# EAGLE design picoAvaR7 (EAGLE 6.1)
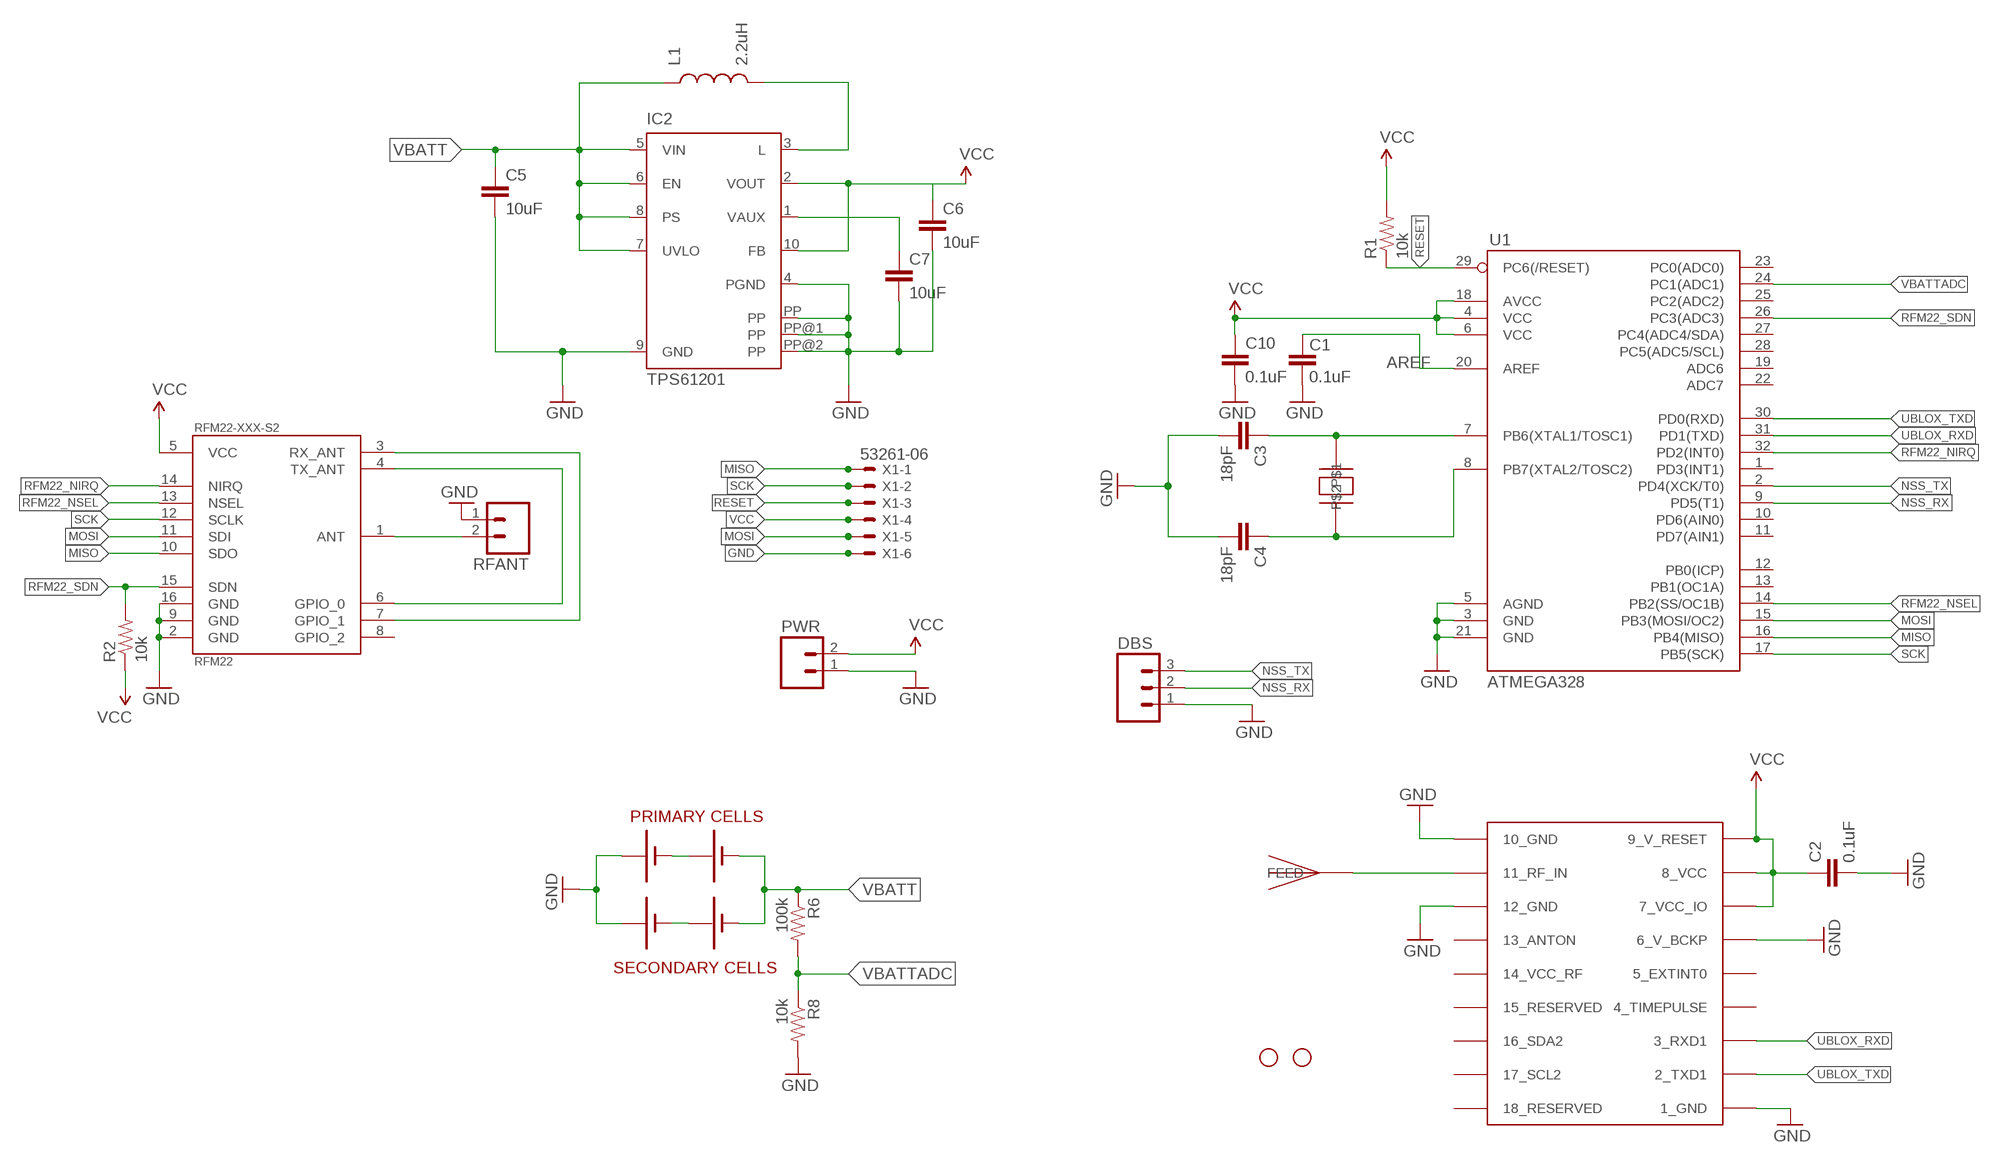
[diagram p0: schematic, sheet 1]

## Parts
C1  0.1uF  CAP0402-CAP  [0402-CAP]
C2  0.1uF  CAP0402-CAP  [0402-CAP]
C3  18pF  CAP0402-CAP  [0402-CAP]
C4  18pF  CAP0402-CAP  [0402-CAP]
C5  10uF  CAP1206  [1206]
C6  10uF  CAP1206  [1206]
C7  10uF  CAP1206  [1206]
C10  0.1uF  CAP0402-CAP  [0402-CAP]
DBS  M03PTH  [1X03]
IC2  TPS61201  [S-PDSO-N10]
JP1  STAND-OFF  [STAND-OFF]
JP2  STAND-OFF  [STAND-OFF]
L1  2.2uH  ELLVGG_INDUCTOR  [ELLVGG_INDUCTOR]
PRIMARYCELL1  KEYSTONE-82-AAA-BATTERY-HOLDER  [KEYSTONE-82-AAA-BATTERY]
PRIMARYCELL2  KEYSTONE-82-AAA-BATTERY-HOLDER  [KEYSTONE-82-AAA-BATTERY]
PWR  M02PTH  [1X02]
R1  10k  RESISTOR0402-RES  [0402-RES]
R2  10k  RESISTOR0402-RES  [0402-RES]
R6  100k  RESISTOR0402-RES  [0402-RES]
R8  10k  RESISTOR0402-RES  [0402-RES]
RFANT  M02PTH  [1X02]
RFM22-XXX-S2  RFM22  [RFM22-XXX-S2]
SECONDARYCELL1  KEYSTONE-82-AAA-BATTERY-HOLDER  [KEYSTONE-82-AAA-BATTERY]
SECONDARYCELL2  KEYSTONE-82-AAA-BATTERY-HOLDER  [KEYSTONE-82-AAA-BATTERY]
U1  ATMEGA328  ATMEGA168  [TQFP32-08]
U$1  UBLOX_MAX-6  [UBLOX_MAX-6]
U$2  ABRACON_ABM3_CRYSTAL  [ABRACON_ABM3_CRYSTAL]
U$3  JTI_ANTENNA-1575AT43A40  [JTI_ANTENNA-1575AT43A40]
X1  53261-06  [53261-06]

## Nets
AREF: C1.2 U1.20(AREF)
GND [vcc]: C1.1 C2.2 C3.2 C4.2 C5.2 C6.2 C7.2 C10.2 DBS.1 IC2.4(PGND) IC2.9(GND) IC2.PP IC2.PP@1(PP) IC2.PP@2(PP) PRIMARYCELL1.VBATT1(+) PRIMARYCELL1.VBATT(+) PWR.1 R8.2 RFANT.1 RFM22-XXX-S2.2(GND) RFM22-XXX-S2.9(GND) RFM22-XXX-S2.16(GND) SECONDARYCELL1.VBATT1(+) SECONDARYCELL1.VBATT(+) U1.3(GND) U1.5(AGND) U1.21(GND) U$1.1_GND U$1.6_V_BCKP U$1.10_GND U$1.12_GND X1.6
MISO: RFM22-XXX-S2.10(SDO) U1.16(PB4(MISO)) X1.1
MOSI: RFM22-XXX-S2.11(SDI) U1.15(PB3(MOSI/OC2)) X1.5
N$1: PRIMARYCELL1.GND2(-) PRIMARYCELL1.GND(-) PRIMARYCELL2.VBATT1(+) PRIMARYCELL2.VBATT(+)
N$2: SECONDARYCELL1.GND2(-) SECONDARYCELL1.GND(-) SECONDARYCELL2.VBATT1(+) SECONDARYCELL2.VBATT(+)
N$3: RFANT.2 RFM22-XXX-S2.1(ANT)
N$4: U$1.11_RF_IN U$3.FEED
N$5: RFM22-XXX-S2.3(RX_ANT) RFM22-XXX-S2.7(GPIO_1)
N$6: RFM22-XXX-S2.4(TX_ANT) RFM22-XXX-S2.6(GPIO_0)
N$7: IC2.3(L) L1.P$2
N$9: C3.1 U1.7(PB6(XTAL1/TOSC1)) U$2.P$2
N$10: C4.1 U1.8(PB7(XTAL2/TOSC2)) U$2.P$1
N$11: C7.1 IC2.1(VAUX)
NSS_RX: DBS.2 U1.9(PD5(T1))
NSS_TX: DBS.3 U1.2(PD4(XCK/T0))
RESET: R1.1 U1.29(PC6(/RESET)) X1.3
RFM22_NIRQ: RFM22-XXX-S2.14(NIRQ) U1.32(PD2(INT0))
RFM22_NSEL: RFM22-XXX-S2.13(NSEL) U1.14(PB2(SS/OC1B))
RFM22_SDN: R2.2 RFM22-XXX-S2.15(SDN) U1.26(PC3(ADC3))
SCK: RFM22-XXX-S2.12(SCLK) U1.17(PB5(SCK)) X1.2
UBLOX_RXD: U1.31(PD1(TXD)) U$1.3_RXD1
UBLOX_TXD: U1.30(PD0(RXD)) U$1.2_TXD1
VBATT [vcc]: C5.1 IC2.5(VIN) IC2.6(EN) IC2.7(UVLO) IC2.8(PS) L1.P$1 PRIMARYCELL2.GND2(-) PRIMARYCELL2.GND(-) R6.1 SECONDARYCELL2.GND2(-) SECONDARYCELL2.GND(-)
VBATTADC: R6.2 R8.1 U1.24(PC1(ADC1))
VCC: C2.1 C6.1 C10.1 IC2.2(VOUT) IC2.10(FB) PWR.2 R1.2 R2.1 RFM22-XXX-S2.5(VCC) U1.4(VCC) U1.6(VCC) U1.18(AVCC) U$1.7_VCC_IO U$1.8_VCC U$1.9_V_RESET X1.4
Unconnected: RFM22-XXX-S2.8(GPIO_2) U1.1(PD3(INT1)) U1.10(PD6(AIN0)) U1.11(PD7(AIN1)) U1.12(PB0(ICP)) U1.13(PB1(OC1A)) U1.19(ADC6) U1.22(ADC7) U1.23(PC0(ADC0)) U1.25(PC2(ADC2)) U1.27(PC4(ADC4/SDA)) U1.28(PC5(ADC5/SCL)) U$1.4_TIMEPULSE U$1.5_EXTINT0 U$1.13_ANTON U$1.14_VCC_RF U$1.15_RESERVED U$1.16_SDA2 U$1.17_SCL2 U$1.18_RESERVED

## Notes on the sheet
- PRIMARY CELLS
- SECONDARY CELLS

## Library data of the parts
C1-C7 C10 = SparkFun:CAP: Capacitor Standard 0603 ceramic capacitor, and 0.1" leaded capacitor.
DBS = SparkFun:M03: Header 3 Standard 3-pin 0.1" header. Use with straight break away headers (SKU : PRT-00116), right angle break away headers (PRT-00553), swiss pins (PRT-00743), machine pins (PRT-00117), and female headers (PRT-00115). Molex polarized connector foot print use with SKU : PRT-08232 with associated crimp pins and housings.
IC2 = texas:TPS6120*: LOW INPUT VOLTAGE SYNCHRONOUS BOOST CONVERTER WITH 1.3-A SWITCHES Source: http://focus.ti.com/lit/ds/symlink/tps61200.pdf; MPN: TPS61201DRCT; OC_FARNELL: unknown; OC_NEWARK: 37M0068
JP1 JP2 = SparkFun:STAND-OFF: Stand Off This is the mechanical footprint for a #4 phillips button head screw. Use the keepout ring to avoid running the screw head into surrounding components. SKU : PRT-00447
L1 = ava:ELLVGG_INDUCTOR
PRIMARYCELL1 PRIMARYCELL2 SECONDARYCELL1 SECONDARYCELL2 = ava:KEYSTONE-82-AAA-BATTERY-HOLDER
PWR RFANT = SparkFun:M02: Header 2 Standard 2-pin 0.1" header. Use with straight break away headers (SKU : PRT-00116), right angle break away headers (PRT-00553), swiss pins (PRT-00743), machine pins (PRT-00117), and female headers (PRT-00115). Molex polarized connector foot print use with SKU : PRT-08233 with associated crimp pins and housings.
R1 R2 R6 R8 = SparkFun:RESISTOR: Resistor Basic schematic elements and footprints for 0603, 1206, and PTH resistors.
RFM22-XXX-S2 = SparkFun:RFM22: *Hope RF's RFM22* Packages: RFM22-S2 (SMD)
U1 = SparkFun:ATMEGA168
U$1 = ava:UBLOX_MAX-6: UBLOX MAX-6
U$2 = ava:ABRACON_ABM3_CRYSTAL
U$3 = ava:JTI_ANTENNA-1575AT43A40
X1 = con-molex:53?-06: CONNECTOR wire to board 1.25 mm (.049 inch) pitch header; OC_FARNELL: 1125375; OC_NEWARK: unknown

## Net classes
0 default: width 0.203 mm
1 vcc: width 0.254 mm

## Board
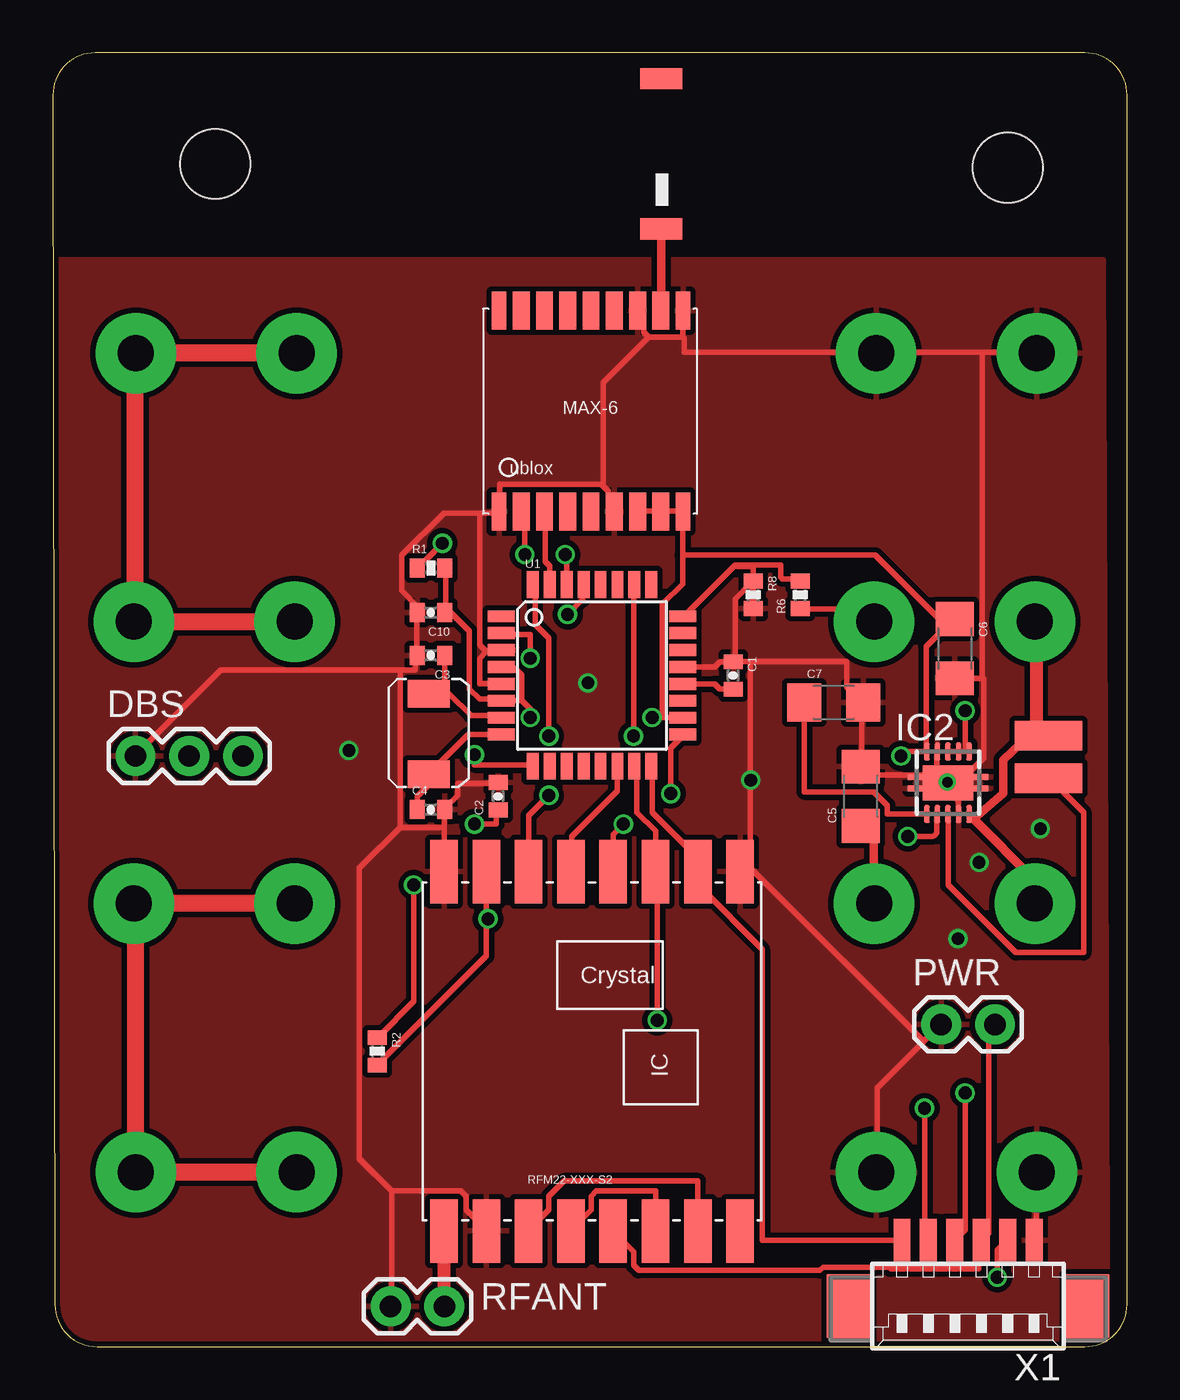
[diagram p1: board, top side]
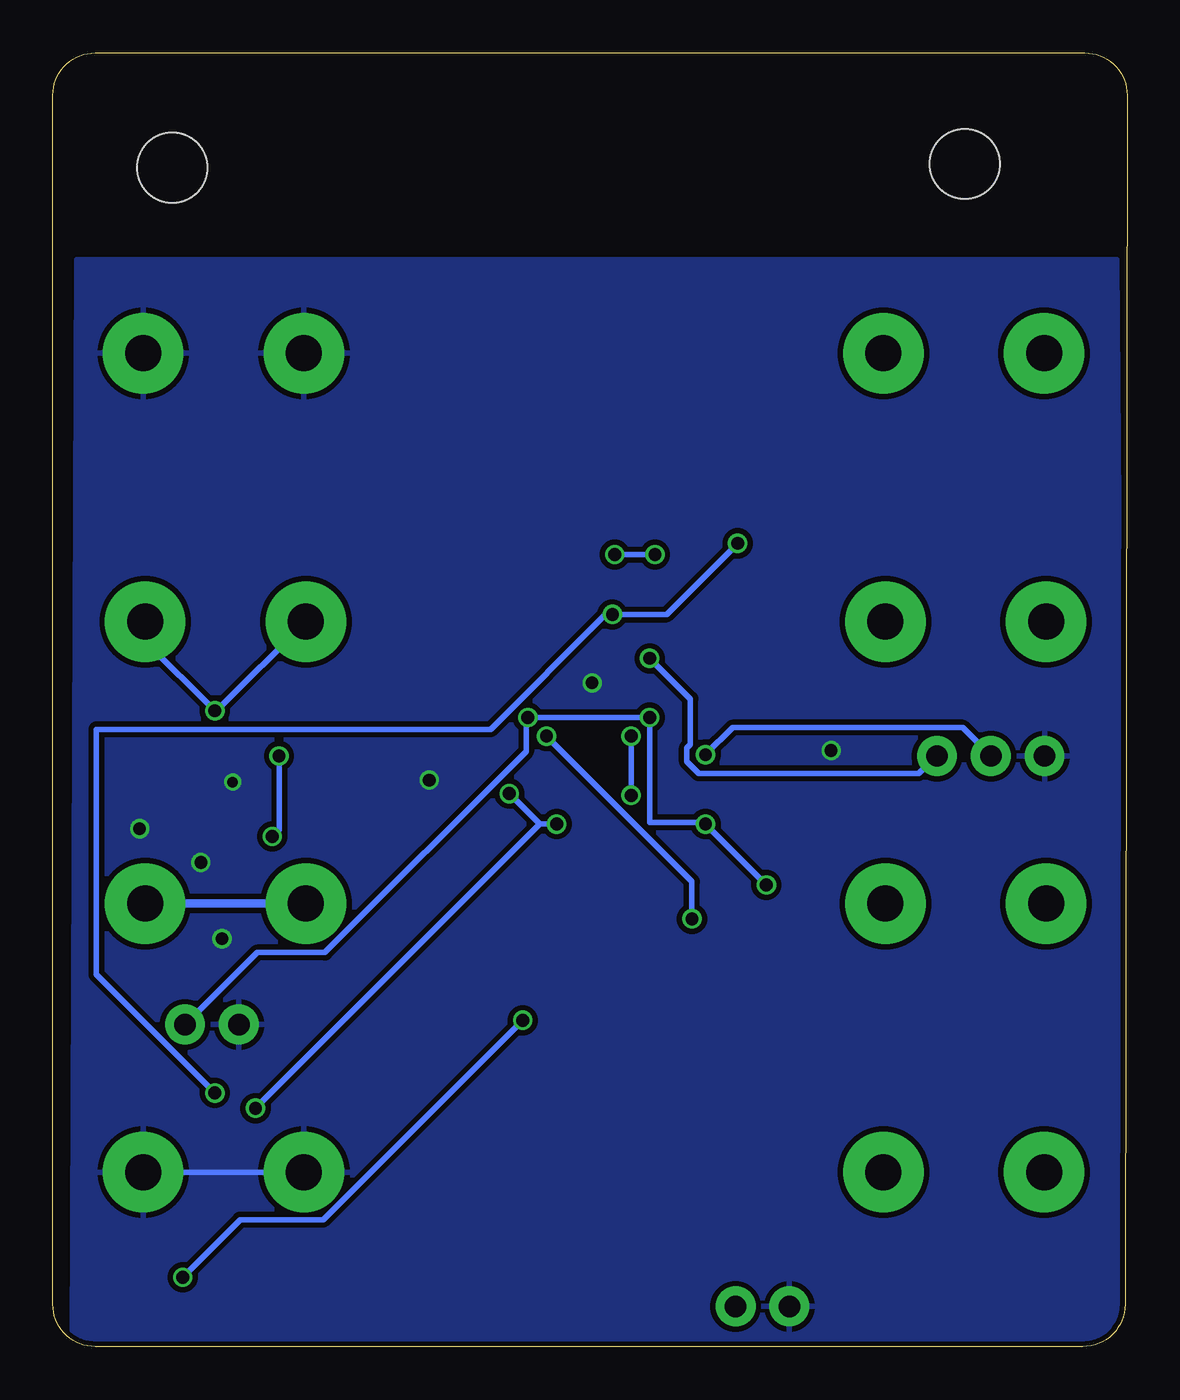
[diagram p2: board, bottom side, seen from below]

Size 50.8 x 61.2 mm. Coordinates in mm from the lower left corner, seen from the top.
Outline: 0,59.2 0.09,2 arc90 2.09,0 48.8,0 arc90 50.8,2 50.8,59.2 arc90 48.8,61.2 2,61.2 arc90 0,59.2
Copper layers (1*16): Top 0.035mm / dielectric 1.5mm / Bottom 0.035mm
Design rules: minimum track width 6mil, minimum drill 12mil, track to track 6mil, track to pad 6mil, pad to pad 6mil, via to via 6mil, smd to smd 0mil, copper to edge 10mil, drill to drill 10mil, minimum pad ring 10mil, minimum via ring 6mil, stop-mask expansion 2mil, vias tented up to drill 100mil, thermal gap 10mil

### Footprints (pad centres in the part's own frame; a part is rotated, then mirrored left to right if it is on the bottom)
0402-CAP = smd 0.7 x 0.9: 1 -0.65,0; 2 0.65,0
1206 = smd 1.6 x 1.8: 1 -1.4,0; 2 1.4,0
1X03 = drill 1.016 pad 1.88: 1 0,0; 2 2.54,0; 3 5.08,0
S-PDSO-N10 = smd 0.28 x 0.85: 1 -1,-1.475; 2 -0.5,-1.475; 3 0,-1.475; 4 0.5,-1.475; 5 1,-1.475; 6 1,1.475; 7 0.5,1.475; 8 0,1.475; 9 -0.5,1.475; 10 -1,1.475 | smd 2.4 x 1.65: PP 0,0 | smd 3.8 x 0.28: PP@1 0,0.275; PP@2 0,-0.275
STAND-OFF = hole 3.302: 0,0
ELLVGG_INDUCTOR = smd 1.4 x 3.2: P$1 -3.81,0; P$2 -1.81,0
KEYSTONE-82-AAA-BATTERY = drill 1.7 pad 3.81: GND -21.57,0; GND2 -13.97,0; VBATT 13.43,0; VBATT1 21.03,0
1X02 = drill 1.016 pad 1.88: 1 0,0; 2 2.54,0
0402-RES = smd 0.7 x 0.9: 1 -0.65,0; 2 0.65,0
RFM22-XXX-S2 = smd 3 x 1.3: 1 -8.5,7; 2 -8.5,5; 3 -8.5,3; 4 -8.5,1; 5 -8.5,-1; 6 -8.5,-3; 7 -8.5,-5; 8 -8.5,-7; 9 8.5,-7; 10 8.5,-5; 11 8.5,-3; 12 8.5,-1; 13 8.5,1; 14 8.5,3; 15 8.5,5; 16 8.5,7
TQFP32-08 = smd 1.27 x 0.559: 1 -4.293,2.8; 2 -4.293,2; 3 -4.293,1.2; 4 -4.293,0.4; 5 -4.293,-0.4; 6 -4.293,-1.2; 7 -4.293,-2; 8 -4.293,-2.8; 17 4.293,-2.8; 18 4.293,-2; 19 4.293,-1.2; 20 4.293,-0.4; 21 4.293,0.4; 22 4.293,1.2; 23 4.293,2; 24 4.293,2.8 | smd 0.559 x 1.27: 9 -2.8,-4.293; 10 -2,-4.293; 11 -1.2,-4.293; 12 -0.4,-4.293; 13 0.4,-4.293; 14 1.2,-4.293; 15 2,-4.293; 16 2.8,-4.293; 25 2.8,4.293; 26 2,4.293; 27 1.2,4.293; 28 0.4,4.293; 29 -0.4,4.293; 30 -1.2,4.293; 31 -2,4.293; 32 -2.8,4.293
UBLOX_MAX-6 = smd 1.8 x 0.7: 1_GND 4.95,-4.4; 9_V_RESET 4.95,4.3; 10_GND -4.55,4.3; 18_RESERVED -4.55,-4.4 | smd 1.8 x 0.8: 2_TXD1 4.95,-3.35; 3_RXD1 4.95,-2.25; 4_TIMEPULSE 4.95,-1.15; 5_EXTINT0 4.95,-0.05; 6_V_BCKP 4.95,1.05; 7_VCC_IO 4.95,2.15; 8_VCC 4.95,3.25; 11_RF_IN -4.55,3.25; 12_GND -4.55,2.15; 13_ANTON -4.55,1.05; 14_VCC_RF -4.55,-0.05; 15_RESERVED -4.55,-1.15; 16_SDA2 -4.55,-2.25; 17_SCL2 -4.55,-3.35
ABRACON_ABM3_CRYSTAL = smd 1.3 x 2: P$1 -3.4,0.1; P$2 0.4,0.1
JTI_ANTENNA-1575AT43A40 = smd 1 x 2: FEED -3.81,-1.27; NC 3.29,-1.27
53261-06 = smd 0.8 x 2: 1 3.125,-2.5; 2 1.875,-2.5; 3 0.625,-2.5; 4 -0.625,-2.5; 5 -1.875,-2.5; 6 -3.125,-2.5 | smd 2.1 x 3: S1 5.625,0.625; S2 -5.625,0.625

### Placement (x,y rotation side)
C1  32.16,31.75 270 top
C2  21.05,26.04 90 top
C3  17.88,32.7 180 top
C4  17.88,25.4 0 top
C5  38.2,26.04 90 top
C6  42.64,33.02 270 top
C7  36.93,30.48 0 top
C10  17.88,34.73 180 top
DBS  3.91,27.94 0 top
IC2  42.32,26.67 0 top
JP1  7.68,55.95 0 top
JP2  45.15,55.77 0 top
L1  47.09,25.08 270 top
PRIMARYCELL1  25.5,8.26 0 top
PRIMARYCELL2  24.86,20.95 180 top
PWR  42.01,15.24 0 top
R1  17.88,36.83 0 top
R2  15.34,13.97 270 top
R6  35.34,35.56 90 top
R8  33.12,35.56 270 top
RFANT  15.97,1.91 0 top
RFM22-XXX-S2  25.5,13.97 90 top
SECONDARYCELL1  25.5,46.99 0 top
SECONDARYCELL2  24.86,34.29 180 top
U1  25.5,31.75 0 top
U$1  25.5,44.45 270 top
U$2  17.88,30.48 90 top
U$3  27.5,56.68 90 top
X1  43.28,2.54 180 top

### Tracks (layer width: path | path; a pad name or v marks a point on that pad's centre or on a via)
AREF
  Top 0.254: U1.20 31.29,31.35 31.53,31.11 32.15,31.11 C1.2
GND  (via drill 0.5, 0.6)
  Top 0.254: U1.21 31.29,32.15 31.53,32.38 32.15,32.38 C1.1 | IC2.4 42.82,25.84 42.34,26.32 IC2.PP@2 IC2.PP | 43.94,31.6 44.02,31.6 44.02,27.84 42.5,26.32 IC2.PP | 43.94,31.6 42.66,31.6 C6.2 | IC2.PP 42.34,26.72 42.34,26.88 IC2.PP@1 42.26,27.04 | R8.2 33.06,36.16 32.26,35.36 32.26,32.48 C1.1 | 32.98,32.4 37.54,32.4 37.54,31.2 38.18,30.56 C7.2 38.26,30.48 38.26,27.44 C5.2 38.34,27.36 38.34,27.04 42.26,27.04 | 32.98,32.4 C1.1 | 32.98,32.4 32.98,22.96 RFM22-XXX-S2.9 32.9,22.72 41.06,14.56 41.06,14.48 41.14,14.4 | X1.6 46.42,5.04 46.5,5.12 46.5,8.24 PRIMARYCELL1.VBATT1 | 41.14,14.4 38.98,12.24 38.98,8.32 PRIMARYCELL1.VBATT | 41.14,14.4 41.94,15.2 PWR.1 | 43.94,47.04 46.5,47.04 SECONDARYCELL1.VBATT1 | 43.94,47.04 38.98,47.04 SECONDARYCELL1.VBATT 38.82,47.04 29.86,47.04 29.86,47.68 29.78,47.76 | 16.02,7.36 19.3,7.36 19.54,7.12 19.54,6.48 20.5,5.52 RFM22-XXX-S2.2 | 16.02,7.36 16.02,1.92 RFANT.1 | RFM22-XXX-S2.16 18.5,24.56 | 18.5,24.56 18.5,25.36 C4.2 18.58,25.52 19.14,26.08 19.14,26.64 20.98,26.64 C2.2 | 28.18,47.76 27.94,48 27.94,48.72 27.7,48.96 U$1.12_GND | 29.78,47.76 28.18,47.76 | 29.78,47.76 29.78,48.96 U$1.10_GND | 20.5,32.88 20.18,32.56 20.18,31.36 21.14,31.36 U1.5 | 20.5,32.88 21.14,32.88 U1.3 | 20.18,39.44 21.06,39.44 U$1.1_GND 21.14,39.6 21.14,40.8 25.94,40.8 | 20.18,39.44 18.5,39.44 16.5,37.44 16.5,35.76 17.22,35.04 C10.2 17.22,34.88 17.22,32.72 C3.2 17.14,32.64 17.14,32 16.42,32 | 25.94,40.8 26.26,40.48 26.26,39.76 26.5,39.52 U$1.6_V_BCKP | 20.5,32.88 20.18,33.2 20.18,39.44 | 28.18,47.76 26.02,45.6 26.02,40.88 25.94,40.8 | 16.42,32 7.94,32 3.94,28 DBS.1 | 16.42,24.56 18.5,24.56
  Top 0.254: 16.42,32 16.42,24.56 | 16.02,7.36 14.5,8.88 14.5,22.64 16.42,24.56 | 43.94,47.04 43.94,31.6 | 42.26,27.04 41.8,27.5 41.8,28.12 IC2.9
  Bottom 0.254: PRIMARYCELL1.VBATT1 46.5,8.24 38.98,8.24 PRIMARYCELL1.VBATT
  other vias: 33,26.8 46.7,24.5 43.8,22.9 42.8,19.3 25.3,31.4 14,28.2 42.3,26.7
  pour Top (isolate 0.254): 0.1,51.42 49.68,51.42 49.88,0 2.1,0 arc-90 0.1,2
  pour Bottom (isolate 0.254): 0.5,51.42 49.68,51.42 49.88,0 2.1,0 arc-90 0.1,2
MISO
  Top 0.254: U1.16 28.34,27.44 28.34,25.28 30.5,23.12 RFM22-XXX-S2.10 30.58,22.4 30.58,21.76 33.54,18.8 33.54,5.04 X1.1
MOSI  (via drill 0.61)
  Top 0.254: U1.15 27.54,27.44 27.62,27.36 27.62,25.28 28.5,24.4 RFM22-XXX-S2.11 28.58,22.4 v28.58,15.44 | v44.66,3.28 44.66,4.56 X1.5
  Bottom 0.254: v44.66,3.28 41.94,6 38.02,6 v28.58,15.44
N$1
  Top 0.813: PRIMARYCELL2.VBATT1 3.91,20.95 | 11.43,8.35 PRIMARYCELL1.GND2 PRIMARYCELL1.GND 3.91,8.28 3.91,20.95 | PRIMARYCELL2.VBATT 3.91,20.95
N$2
  Top 0.813: 3.91,34.29 SECONDARYCELL2.VBATT 11.53,34.38 | SECONDARYCELL1.GND2 SECONDARYCELL1.GND | SECONDARYCELL1.GND 3.91,46.99 | SECONDARYCELL2.VBATT1 3.91,34.29 | 3.91,34.29 3.91,46.97 SECONDARYCELL1.GND
N$3
  Top 0.254: RFANT.2
  Top 0.61: RFANT.2 RFM22-XXX-S2.1
N$4
  Top 0.406: U$3.FEED 28.77,49.02 U$1.11_RF_IN
N$5
  Top 0.254: RFM22-XXX-S2.7 30.5,7.84 24.18,7.84 23.46,7.12 23.46,6.48 22.5,5.52 RFM22-XXX-S2.3
N$6
  Top 0.254: RFM22-XXX-S2.6 28.5,7.36 25.7,7.36 25.46,7.12 25.46,6.48 24.5,5.52 RFM22-XXX-S2.4
N$7
  Top 0.254: IC2.3 42.34,25.12 42.34,21.84 45.54,18.64 48.74,18.64 48.74,25.28 47.14,26.88 L1.P$2
N$9
  Top 0.254: U1.7 21.11,29.84 19.78,29.84 18.75,30.88 U$2.P$2 17.86,30.8 17.88,30.8 18.53,31.45 C3.1
N$10
  Top 0.254: U1.8 19.65,28.95 U$2.P$1 17.78,26.57 17.24,26.04 17.24,25.41 C4.1
N$11
  Top 0.254: IC2.1 41.3,25.2 39.46,25.2 39.46,25.6 38.82,26.24 35.54,26.24 C7.1
NSS_RX  (via drill 0.61)
  Top 0.254: v19.94,28 19.94,27.52 22.66,27.52 U1.9
  Bottom 0.254: v19.94,28 18.66,29.28 7.78,29.28 6.5,28 DBS.2
NSS_TX  (via drill 0.61)
  Top 0.254: v22.58,32.56 22.58,33.68 21.22,33.68 U1.2
  Bottom 0.254: v22.58,32.56 20.66,30.64 20.66,28.48 20.82,28.32 20.82,27.68 20.26,27.12 9.86,27.12 9.06,27.92 DBS.3
RESET  (via drill 0.61)
  Top 0.254: v18.42,38 17.3,36.88 R1.1 | v24.34,34.64 25.06,35.36 25.06,36 U1.29 | v43.14,12 43.14,5.52 X1.3
  Bottom 0.254: v18.42,38 21.78,34.64 v24.34,34.64 24.42,34.56 24.74,34.56 30.1,29.2 48.74,29.2 48.74,17.6 v43.14,12
RFM22_NIRQ  (via drill 0.61)
  Top 0.254: v23.46,28.88 23.46,33.52 22.82,34.16 22.82,35.92 22.74,36 U1.32 | v23.46,26.08 22.5,25.12 RFM22-XXX-S2.14
  Bottom 0.254: v23.46,26.08 v23.46,28.88
RFM22_NSEL
  Top 0.254: U1.14 26.7,26.28 24.54,24.13 24.54,22.52 RFM22-XXX-S2.13
RFM22_SDN  (via drill 0.61)
  Top 0.254: R2.2 20.5,18.48 20.5,20.24 | RFM22-XXX-S2.15 20.5,20.24 | v27.46,28.88 27.46,36 U1.26 | v20.58,20.24 20.5,20.24
  Bottom 0.254: v27.46,28.88 20.58,22 v20.58,20.24
SCK  (via drill 0.61)
  Top 0.254: v29.22,26.16 29.22,28.32 29.78,28.88 U1.17 | v26.98,24.72 26.5,24.24 RFM22-XXX-S2.12 | v41.22,11.28 41.22,5.2 41.38,5.04 X1.2
  Bottom 0.254: 27.78,24.72 v29.22,26.16 | v26.98,24.72 27.78,24.72 | 27.78,24.72 v41.22,11.28
UBLOX_RXD
  Top 0.254: U1.31 23.5,36.92 23.27,37.15 23.27,39.47 U$1.3_RXD1
UBLOX_TXD  (via drill 0.6)
  Top 0.254: U1.30 24.3,37.4 v24.23,37.47 | v22.32,37.47 22.32,39.33 U$1.2_TXD1
  Bottom 0.254: v24.23,37.47 v22.32,37.47
VBATT  (via drill 0.61)
  Top 0.254: 38.82,24 38.26,24.56 C5.1 | PRIMARYCELL2.GND2 | 43.54,24.96 43.38,25.12 IC2.5 | 46.42,20.96 PRIMARYCELL2.GND | R6.1 35.38,34.88 38.82,34.88 38.82,34.32 SECONDARYCELL2.GND2 | IC2.8 IC2.7 42.9,28.16 43.14,28.16 | 43.14,28.16 43.3,28.16 IC2.6 | v43.14,30.08 43.14,28.16 | 46.5,29.52 47.06,28.96 L1.P$1 46.58,29.28 | 46.5,34.24 SECONDARYCELL2.GND
  Top 0.406: PRIMARYCELL2.GND2 38.82,24 | 46.42,20.96 46.42,22.08 43.54,24.96 44.94,26.16 44.94,27.74 46.58,29.28
  Top 0.61: 46.5,34.24 46.5,29.52
  Bottom 0.254: 38.9,20.96 PRIMARYCELL2.GND2 | 46.42,20.96 PRIMARYCELL2.GND | SECONDARYCELL2.GND 46.42,34.24 46.42,33.36 v43.14,30.08 43.06,30.16 42.98,30.16 38.9,34.24 SECONDARYCELL2.GND2
  Bottom 0.406: 46.42,20.96 38.9,20.96
VBATTADC
  Top 0.254: 33.14,34.96 R8.1 33.12,36.85 arc45 33.1,36.9 32.5,36.9 | R6.2 35.3,36.24 35.3,36.32 34.5,36.32 34.42,36.4 34.42,36.96 32.35,36.96 | U1.24 29.86,34.56 32.26,36.96 32.35,36.96 | 32.5,36.9 32.4,36.9 | 32.35,36.96 arc-45 32.5,36.9
VCC  (via drill 0.6, 0.61)
  Top 0.254: PWR.2 44.5,15.2 44.26,14.96 44.26,5.36 43.94,5.04 X1.4 43.78,5.04 43.78,3.68 39.62,3.68 39.54,3.76 36.42,3.76 36.26,3.6 27.7,3.6 27.46,3.84 27.46,4.48 26.5,5.44 RFM22-XXX-S2.5 | U$1.7_VCC_IO 27.7,39.52 28.74,39.52 U$1.8_VCC 28.82,39.52 29.7,39.52 U$1.9_V_RESET 29.78,39.44 29.78,37.44 | 28.82,29.76 U1.18 | 28.82,29.76 28.82,35.12 29.78,36.08 29.78,37.44 | 29.78,37.44 38.9,37.44 42.18,34.16 C6.1 42.58,34.4 41.3,33.12 41.3,28.16 IC2.10 40.31,28.14 v40.1,27.94 | R1.2 18.58,36.8 18.58,34.96 C10.1 18.66,34.88 19.7,33.84 19.7,31.12 20.18,30.64 21.14,30.64 U1.6 22.18,30.56 | 22.18,30.56 22.18,31.76 21.86,32.08 21.22,32.08 U1.4 | v17.06,21.84 17.06,16.32 15.38,14.64 R2.1 | v19.94,24.72 20.98,24.72 20.98,25.36 C2.1 | 22.18,30.56 22.58,30.16 v22.58,29.76 | v28.34,29.76 28.82,29.76 | v40.42,24.13 41.59,24.13 41.69,24.19 41.8,24.3 41.8,25.2 IC2.2
  Bottom 0.254: v17.06,21.84 v19.94,24.72 20.02,24.8 22.58,24.8 v22.58,29.76 v28.34,29.76 28.42,29.68 28.42,28.16 37.94,18.64 41.14,18.64 44.5,15.28 PWR.2 | v40.1,27.94 40.1,24.45 v40.42,24.13